# EAGLE design IOIO (EAGLE 5.11)
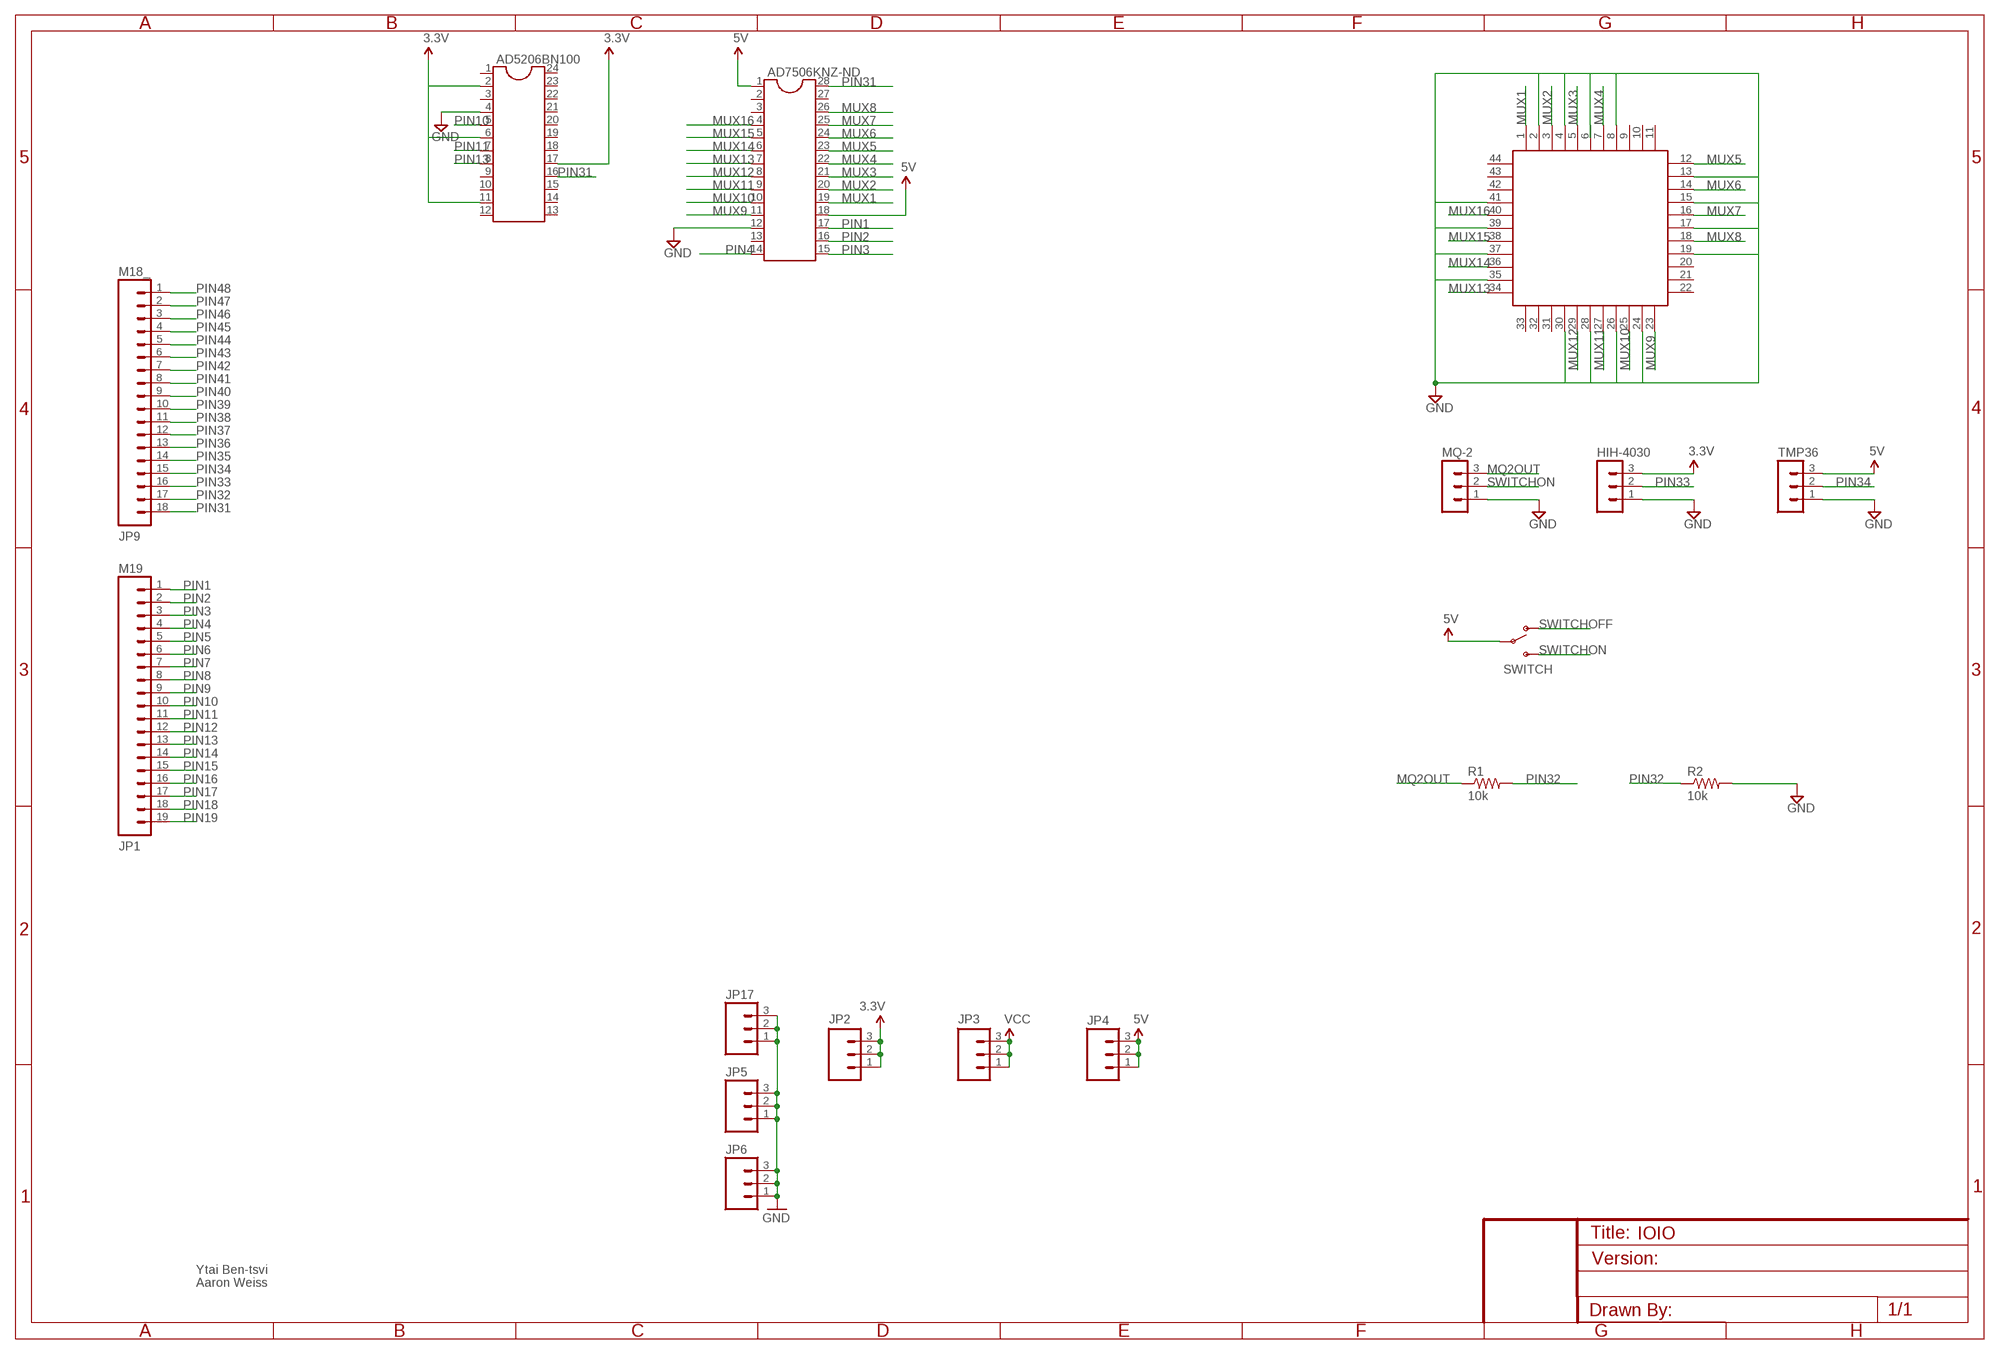
[diagram p0: schematic, sheet 1]

## Parts
AD5206BN100  DIL24-3  [DIL24-3]
AD7506KNZ-ND  DIL28  [DIL28-6]
HIH-4030  MA03-1  [MA03-1]
JP1  M19  [1X19]
JP2  M03PTH  [1X03]
JP3  M03PTH  [1X03]
JP4  M03PTH  [1X03]
JP5  M03PTH  [1X03]
JP6  M03PTH  [1X03]
JP9  M18_  [1X18]
JP17  M03PTH  [1X03]
MQ-2  MA03-1  [MA03-1]
R1  10k  R-US_0207/7  [0207/7]
R2  10k  R-US_0207/7  [0207/7]
SWITCH  SWITCH-SPSTPTH  [SWITCH-SPDT]
TMP36  MA03-1  [MA03-1]
U$1  S44  [S44]

## Nets
3.3V: AD5206BN100.2 AD5206BN100.6 AD5206BN100.11 AD5206BN100.17 HIH-4030.3 JP2.1 JP2.2 JP2.3
5V: AD7506KNZ-ND.1 AD7506KNZ-ND.18 JP4.1 JP4.2 JP4.3 SWITCH.2(P) TMP36.3
GND: AD5206BN100.4 AD7506KNZ-ND.12 HIH-4030.1 JP5.1 JP5.2 JP5.3 JP6.1 JP6.2 JP6.3 JP17.1 JP17.2 JP17.3 MQ-2.1 R2.2 TMP36.1 U$1.2 U$1.4 U$1.8 U$1.13 U$1.15 U$1.17 U$1.19 U$1.24 U$1.26 U$1.28 U$1.30 U$1.35 U$1.37 U$1.39 U$1.41
MQ2OUT: MQ-2.3 R1.1
MUX1: AD7506KNZ-ND.19 U$1.1
MUX2: AD7506KNZ-ND.20 U$1.3
MUX3: AD7506KNZ-ND.21 U$1.5
MUX4: AD7506KNZ-ND.22 U$1.7
MUX5: AD7506KNZ-ND.23 U$1.12
MUX6: AD7506KNZ-ND.24 U$1.14
MUX7: AD7506KNZ-ND.25 U$1.16
MUX8: AD7506KNZ-ND.26 U$1.18
MUX9: AD7506KNZ-ND.11 U$1.23
MUX10: AD7506KNZ-ND.10 U$1.25
MUX11: AD7506KNZ-ND.9 U$1.27
MUX12: AD7506KNZ-ND.8 U$1.29
MUX13: AD7506KNZ-ND.7 U$1.34
MUX14: AD7506KNZ-ND.6 U$1.36
MUX15: AD7506KNZ-ND.5 U$1.38
MUX16: AD7506KNZ-ND.4 U$1.40
PIN1: AD7506KNZ-ND.17 JP1.1
PIN2: AD7506KNZ-ND.16 JP1.2
PIN3: AD7506KNZ-ND.15 JP1.3
PIN4: AD7506KNZ-ND.14 JP1.4
PIN5: JP1.5
PIN6: JP1.6
PIN7: JP1.7
PIN8: JP1.8
PIN9: JP1.9
PIN10: AD5206BN100.5 JP1.10
PIN11: AD5206BN100.7 JP1.11
PIN12: JP1.12
PIN13: AD5206BN100.8 JP1.13
PIN14: JP1.14
PIN15: JP1.15
PIN16: JP1.16
PIN17: JP1.17
PIN18: JP1.18
PIN19: JP1.19
PIN31: AD5206BN100.16 AD7506KNZ-ND.28 JP9.18
PIN32: JP9.17 R1.2 R2.1
PIN33: HIH-4030.2 JP9.16
PIN34: JP9.15 TMP36.2
PIN35: JP9.14
PIN36: JP9.13
PIN37: JP9.12
PIN38: JP9.11
PIN39: JP9.10
PIN40: JP9.9
PIN41: JP9.8
PIN42: JP9.7
PIN43: JP9.6
PIN44: JP9.5
PIN45: JP9.4
PIN46: JP9.3
PIN47: JP9.2
PIN48: JP9.1
SWITCHOFF: SWITCH.1(O)
SWITCHON: MQ-2.2 SWITCH.3(S)
VCC: JP3.1 JP3.2 JP3.3
Unconnected: AD5206BN100.1 AD5206BN100.3 AD5206BN100.9 AD5206BN100.10 AD5206BN100.12 AD5206BN100.13 AD5206BN100.14 AD5206BN100.15 AD5206BN100.18 AD5206BN100.19 AD5206BN100.20 AD5206BN100.21 AD5206BN100.22 AD5206BN100.23 AD5206BN100.24 AD7506KNZ-ND.2 AD7506KNZ-ND.3 AD7506KNZ-ND.13 AD7506KNZ-ND.27 U$1.6 U$1.9 U$1.10 U$1.11 U$1.20 U$1.21 U$1.22 U$1.31 U$1.32 U$1.33 U$1.42 U$1.43 U$1.44

## Notes on the sheet
- Ytai Ben-tsvi
- Aaron Weiss

## Library data of the parts
AD5206BN100 = ic-package:DIL24: Dual In Line
AD7506KNZ-ND = ic-package:DIL28: Dual In Line
HIH-4030 MQ-2 TMP36 = con-lstb:MA03-1: PIN HEADER; OC_FARNELL: unknown; OC_NEWARK: unknown
JP1 = SparkFun:M19
JP2-JP6 JP17 = SparkFun:M03: Header 3 Standard 3-pin 0.1" header. Use with straight break away headers (SKU : PRT-00116), right angle break away headers (PRT-00553), swiss pins (PRT-00743), machine pins (PRT-00117), and female headers (PRT-00115). Molex polarized connector foot print use with SKU : PRT-08232 with associated crimp pins and housings.
JP9 = SparkFun:M18
R1 R2 = rcl:R-US_: RESISTOR, American symbol
SWITCH = SparkFun:SWITCH-SPST: SPST Switch Simple slide switch. Spark Fun Electronics SKU : COM-00102
U$1 = plcc-socket:S44: 44-pin PLCC through-hole socket

## Board
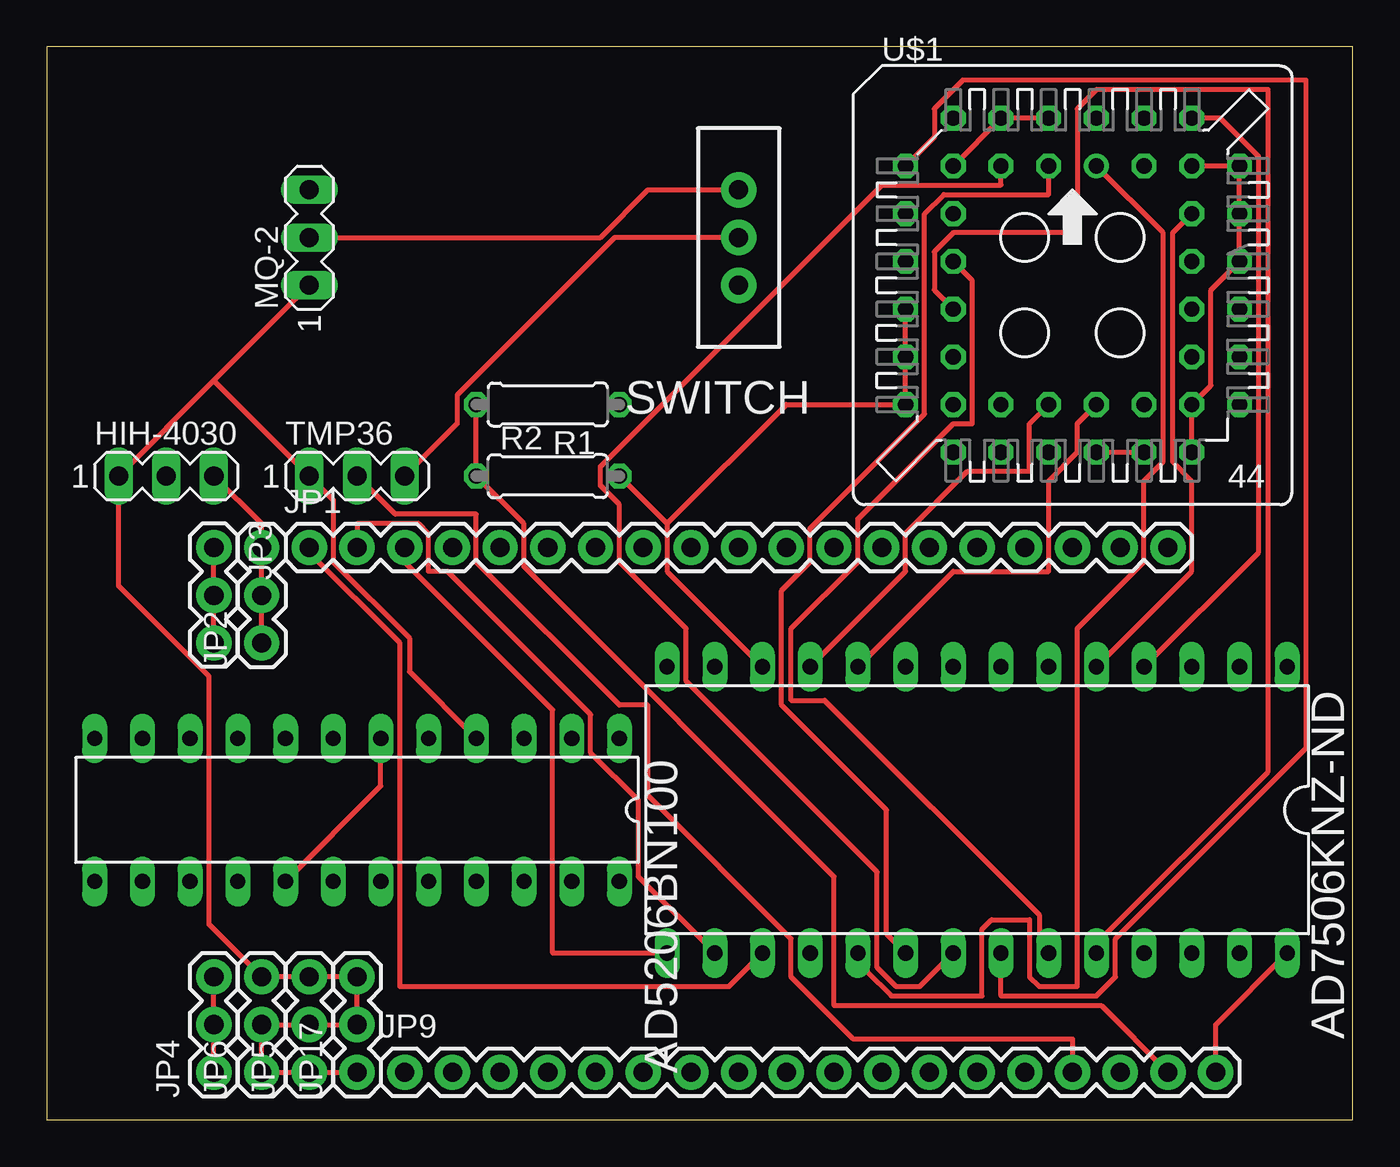
[diagram p1: board, top side]
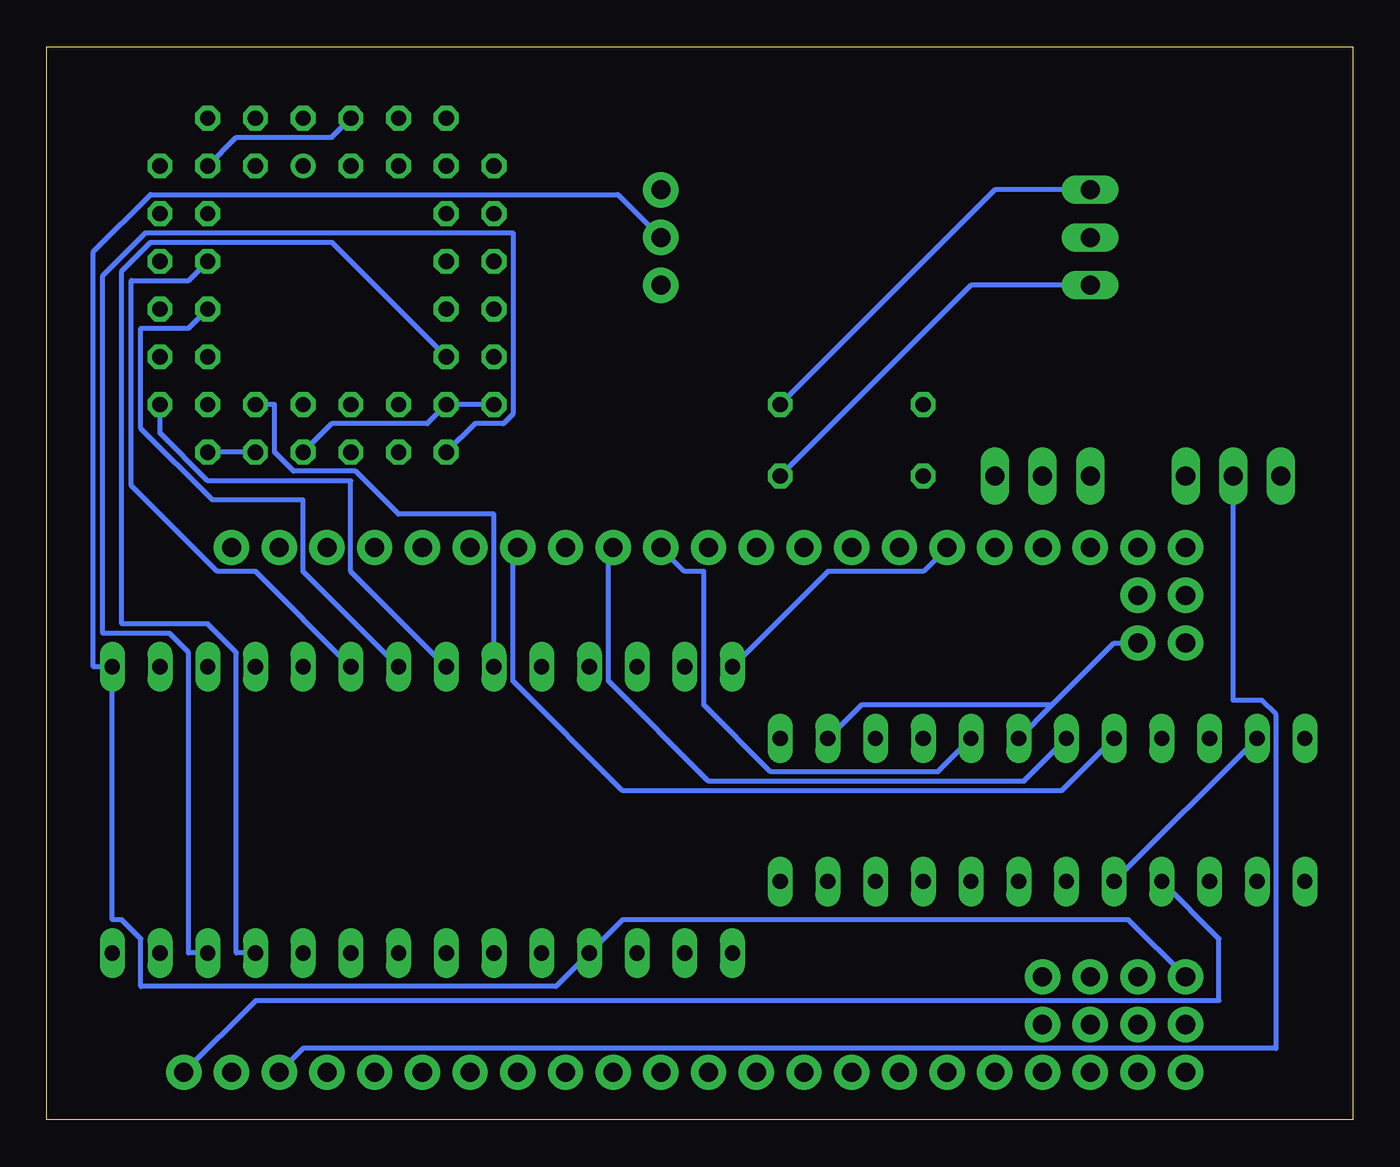
[diagram p2: board, bottom side, seen from below]

Size 69.52 x 57.14 mm. Coordinates in mm from the lower left corner, seen from the top.
Outline: 0,0 69.52,0 69.52,57.14 0,57.14 0,0
Copper layers (1*16): Top 0.035mm / dielectric 1.5mm / Bottom 0.035mm
Design rules "default": minimum track width 10mil, minimum drill 24mil, track to track 8mil, track to pad 8mil, pad to pad 8mil, via to via 8mil, smd to smd 8mil, copper to edge 40mil, drill to drill 8mil, minimum pad ring 10mil, minimum via ring 8mil, stop-mask expansion 4mil, vias tented up to drill 0mil, thermal gap 10mil

### Footprints (pad centres in the part's own frame; a part is rotated, then mirrored left to right if it is on the bottom)
DIL24-3 = drill 0.813 long: 1 -13.97,-3.81; 2 -11.43,-3.81; 3 -8.89,-3.81; 4 -6.35,-3.81; 5 -3.81,-3.81; 6 -1.27,-3.81; 7 1.27,-3.81; 8 3.81,-3.81; 9 6.35,-3.81; 10 8.89,-3.81; 11 11.43,-3.81; 12 13.97,-3.81; 13 13.97,3.81; 14 11.43,3.81; 15 8.89,3.81; 16 6.35,3.81; 17 3.81,3.81; 18 1.27,3.81; 19 -1.27,3.81; 20 -3.81,3.81; 21 -6.35,3.81; 22 -8.89,3.81; 23 -11.43,3.81; 24 -13.97,3.81
DIL28-6 = drill 0.813 long: 1 -16.51,-7.62; 2 -13.97,-7.62; 3 -11.43,-7.62; 4 -8.89,-7.62; 5 -6.35,-7.62; 6 -3.81,-7.62; 7 -1.27,-7.62; 8 1.27,-7.62; 9 3.81,-7.62; 10 6.35,-7.62; 11 8.89,-7.62; 12 11.43,-7.62; 13 13.97,-7.62; 14 16.51,-7.62; 15 16.51,7.62; 16 13.97,7.62; 17 11.43,7.62; 18 8.89,7.62; 19 6.35,7.62; 20 3.81,7.62; 21 1.27,7.62; 22 -1.27,7.62; 23 -3.81,7.62; 24 -6.35,7.62; 25 -8.89,7.62; 26 -11.43,7.62; 27 -13.97,7.62; 28 -16.51,7.62
MA03-1 = drill 1.016 long: 1 -2.54,0; 2 0,0; 3 2.54,0
1X19 = drill 1.016 pad 1.88 round: 1 0,0; 2 2.54,0; 3 5.08,0; 4 7.62,0; 5 10.16,0; 6 12.7,0; 7 15.24,0; 8 17.78,0; 9 20.32,0; 10 22.86,0; 11 25.4,0; 12 27.94,0; 13 30.48,0; 14 33.02,0; 15 35.56,0; 16 38.1,0; 17 40.64,0; 18 43.18,0; 19 45.72,0
1X03 = drill 1.016 pad 1.88 round: 1 0,0; 2 2.54,0; 3 5.08,0
1X18 = drill 1.016 pad 1.88 round: 1 0,0; 2 2.54,0; 3 5.08,0; 4 7.62,0; 5 10.16,0; 6 12.7,0; 7 15.24,0; 8 17.78,0; 9 20.32,0; 10 22.86,0; 11 25.4,0; 12 27.94,0; 13 30.48,0; 14 33.02,0; 15 35.56,0; 16 38.1,0; 17 40.64,0; 18 43.18,0
0207/7 = drill 0.813 octagon: 1 -3.81,0; 2 3.81,0
SWITCH-SPDT = drill 1.016 pad 1.88 round: 1 0,2.54; 2 0,0; 3 0,-2.54
S44 = drill 0.813 round: 1 1.27,6.35 | drill 0.813 octagon: 2 -1.27,8.89; 3 -1.27,6.35; 4 -3.81,8.89; 5 -3.81,6.35; 6 -6.35,8.89; 7 -8.89,6.35; 8 -6.35,6.35; 9 -8.89,3.81; 10 -6.35,3.81; 11 -8.89,1.27; 12 -6.35,1.27; 13 -8.89,-1.27; 14 -6.35,-1.27; 15 -8.89,-3.81; 16 -6.35,-3.81; 17 -8.89,-6.35; 18 -6.35,-8.89; 19 -6.35,-6.35; 20 -3.81,-8.89; 21 -3.81,-6.35; 22 -1.27,-8.89; 23 -1.27,-6.35; 24 1.27,-8.89; 25 1.27,-6.35; 26 3.81,-8.89; 27 3.81,-6.35; 28 6.35,-8.89; 29 8.89,-6.35; 30 6.35,-6.35; 31 8.89,-3.81; 32 6.35,-3.81; 33 8.89,-1.27; 34 6.35,-1.27; 35 8.89,1.27; 36 6.35,1.27; 37 8.89,3.81; 38 6.35,3.81; 39 8.89,6.35; 40 6.35,8.89; 41 6.35,6.35; 42 3.81,8.89; 43 3.81,6.35; 44 1.27,8.89

### Placement (x,y rotation side)
AD5206BN100  16.51,16.51 180 top
AD7506KNZ-ND  49.53,16.51 180 top
HIH-4030  6.35,34.29 0 top
JP1  13.97,30.48 0 top
JP2  11.43,25.4 90 top
JP3  8.89,30.48 270 top
JP4  8.89,2.54 90 top
JP5  13.97,2.54 90 top
JP6  11.43,2.54 90 top
JP9  19.05,2.54 0 top
JP17  16.51,2.54 90 top
MQ-2  13.97,46.99 90 top
R1  26.67,38.1 180 top
R2  26.67,34.29 0 top
SWITCH  36.83,46.99 180 top
TMP36  16.51,34.29 0 top
U$1  54.61,44.45 0 top

### Tracks (layer width: path | path; a pad name or v marks a point on that pad's centre or on a via)
3.3V
  Top 0.254: HIH-4030.3 11.43,31.75 JP2.3 JP2.2 JP2.1 | AD5206BN100.17 17.78,17.78 AD5206BN100.6
  Bottom 0.254: AD5206BN100.11 AD5206BN100.17 | 16,22.1 12.7,25.4 JP2.1 | AD5206BN100.6 16,22.1 | AD5206BN100.2 26.16,22.1 16,22.1
5V
  Top 0.254: TMP36.3 21.84,37.08 21.84,38.61 30.23,46.99 SWITCH.2 | JP4.1 JP4.2 JP4.3
  Bottom 0.254: JP4.3 11.94,10.67 38.86,10.67 AD7506KNZ-ND.18 42.42,7.11 64.52,7.11 64.52,9.65 65.53,10.67 66.04,10.67 AD7506KNZ-ND.1 67.06,24.13 67.06,46.23 64.01,49.28 39.12,49.28 SWITCH.2
GND
  Top 0.254: U$1.41 U$1.39 U$1.37 U$1.35 61.98,44.2 61.98,39.12 U$1.30 U$1.28 | U$1.8 U$1.4 U$1.2 | AD7506KNZ-ND.12 33.02,29.21 33.02,31.75 | R2.2 33.02,31.75 | U$1.24 U$1.26 | U$1.13 U$1.15 U$1.17 39.37,38.1 33.02,31.75 | AD5206BN100.4 19.3,23.88 19.3,25.65 15.24,29.72 15.24,33.02 TMP36.1 8.89,39.37 | JP17.1 JP5.1 JP6.1 JP6.2 JP5.2 JP17.2 JP17.3 JP5.3 JP6.3 8.64,10.41 8.64,23.62 3.81,28.45 HIH-4030.1 8.89,39.37 | 8.89,39.37 MQ-2.1
  Bottom 0.254: U$1.41 59.44,52.32 54.36,52.32 U$1.2 | U$1.26 U$1.28 | U$1.17 U$1.19 49.28,37.08 54.36,37.08 U$1.24 | R2.2 20.32,44.45 MQ-2.1
MQ2OUT
  Bottom 0.254: R1.1 19.05,49.53 MQ-2.3
MUX1
  Top 0.254: AD7506KNZ-ND.19 43.69,8.38 43.69,7.87 44.96,6.6 49.78,6.6 49.78,10.16 50.29,10.67 52.32,10.67 52.32,7.62 52.83,7.11 54.86,7.11 54.86,26.16 58.42,29.72 58.42,34.04 59.44,35.05 59.44,47.24 U$1.1
MUX2
  Top 0.254: AD7506KNZ-ND.20 44.7,9.91 44.7,16.51 39.12,22.1 39.12,28.19 40.64,29.72 40.64,31.5 46.74,37.59 46.74,48.26 47.75,49.28 53.34,49.28 U$1.3
MUX3
  Top 0.254: AD7506KNZ-ND.21 46.48,7.11 45.21,7.11 44.2,8.13 44.2,13.21 34.04,23.37 34.04,26.16 30.48,29.72 30.48,32.77 29.46,33.78 29.46,34.8 44.45,49.78 50.8,49.78 U$1.5
MUX4
  Top 0.254: U$1.7 47.24,52.32 47.24,53.85 48.77,55.37 67.06,55.37 67.06,19.81 56.9,9.65 56.9,7.62 55.88,6.6 50.8,6.6 AD7506KNZ-ND.22
MUX5
  Top 0.254: AD7506KNZ-ND.23 52.83,9.4 52.83,10.92 41.4,22.35 39.62,22.35 39.62,26.16 43.18,29.72 43.18,32 48.26,37.08 49.28,37.08 49.28,44.7 U$1.12
MUX6
  Top 0.254: U$1.14 47.24,44.2 47.24,46.23 48.26,47.24 54.86,47.24 54.86,53.85 55.88,54.86 65.02,54.86 65.02,18.54 55.88,9.4 AD7506KNZ-ND.24
MUX7
  Bottom 0.254: U$1.16 54.36,46.74 64.01,46.74 65.53,45.21 65.53,26.42 60.96,26.42 59.44,24.89 59.44,8.89 AD7506KNZ-ND.25
MUX8
  Bottom 0.254: U$1.18 46.74,37.08 45.21,37.08 44.7,37.59 44.7,47.24 64.26,47.24 66.55,44.96 66.55,25.91 62.99,25.91 61.98,24.89 61.98,8.89 AD7506KNZ-ND.26
MUX9
  Top 0.254: AD7506KNZ-ND.11 45.72,29.21 45.72,31.24 49.02,34.54 52.32,34.54 52.32,37.08 U$1.23
MUX10
  Top 0.254: AD7506KNZ-ND.10 48.26,29.21 53.34,29.21 53.34,34.04 54.86,35.56 54.86,37.08 U$1.25
MUX11
  Bottom 0.254: AD7506KNZ-ND.9 45.72,32.26 50.8,32.26 53.09,34.54 56.39,34.54 57.4,35.56 57.4,38.1 U$1.27
MUX12
  Bottom 0.254: AD7506KNZ-ND.8 53.34,29.21 53.34,34.04 60.96,34.04 63.5,36.58 U$1.29
MUX13
  Bottom 0.254: AD7506KNZ-ND.7 55.88,29.21 55.88,33.02 60.71,33.02 64.52,36.83 64.52,42.16 61.98,42.16 U$1.34
MUX14
  Bottom 0.254: AD7506KNZ-ND.6 58.42,29.21 60.45,29.21 65.02,33.78 65.02,44.7 61.98,44.7 U$1.36
MUX15
  Top 0.254: AD7506KNZ-ND.5 60.96,29.21 60.96,34.04 59.94,35.05 59.94,47.24 U$1.38
MUX16
  Top 0.254: AD7506KNZ-ND.4 64.52,30.23 64.52,51.31 62.48,53.34 U$1.40
PIN1
  Top 0.254: AD7506KNZ-ND.17 36.32,7.11 18.8,7.11 18.8,25.4 13.97,30.23 JP1.1
PIN2
  Top 0.254: AD7506KNZ-ND.16 31.5,12.95 31.5,17.02 28.96,19.56 28.96,21.59 21.34,29.21 20.32,29.21 20.32,31.24 19.81,31.75 16.51,31.75 JP1.2
PIN3
  Top 0.254: AD7506KNZ-ND.15 26.92,8.89 26.92,21.84 19.05,29.72 JP1.3
PIN4
  Bottom 0.254: AD7506KNZ-ND.14 27.94,29.21 22.86,29.21 JP1.4
PIN10
  Bottom 0.254: AD5206BN100.5 22.1,18.54 30.99,18.54 34.54,22.1 34.54,29.21 35.56,29.21 JP1.10
PIN11
  Bottom 0.254: AD5206BN100.7 17.53,18.03 34.29,18.03 39.62,23.37 39.62,30.48 JP1.11
PIN13
  Bottom 0.254: AD5206BN100.8 15.49,17.53 38.86,17.53 44.7,23.37 44.7,30.48 JP1.13
PIN31
  Top 0.254: AD7506KNZ-ND.28 62.23,5.08 JP9.18
  Bottom 0.254: AD5206BN100.16 7.11,9.65 7.11,6.35 58.42,6.35 JP9.18
PIN32
  Top 0.254: R1.2 R2.1 25.4,31.75 25.4,29.46 41.91,12.95 41.91,6.1 56.13,6.1 JP9.17
PIN33
  Bottom 0.254: HIH-4030.2 6.35,22.35 4.83,22.35 4.06,21.59 4.06,3.81 55.88,3.81 JP9.16
PIN34
  Top 0.254: TMP36.2 18.54,32.26 22.86,32.26 22.86,29.72 30.48,22.1 32,22.1 32,17.27 39.62,9.65 39.62,7.62 42.93,4.32 54.61,4.32 JP9.15
SWITCHON
  Top 0.254: MQ-2.2 29.46,46.99 32,49.53 SWITCH.3
VCC
  Top 0.254: JP3.3 JP3.2 JP3.1